# Altium schematic sheet LED_Array_Large.SchDoc
size C
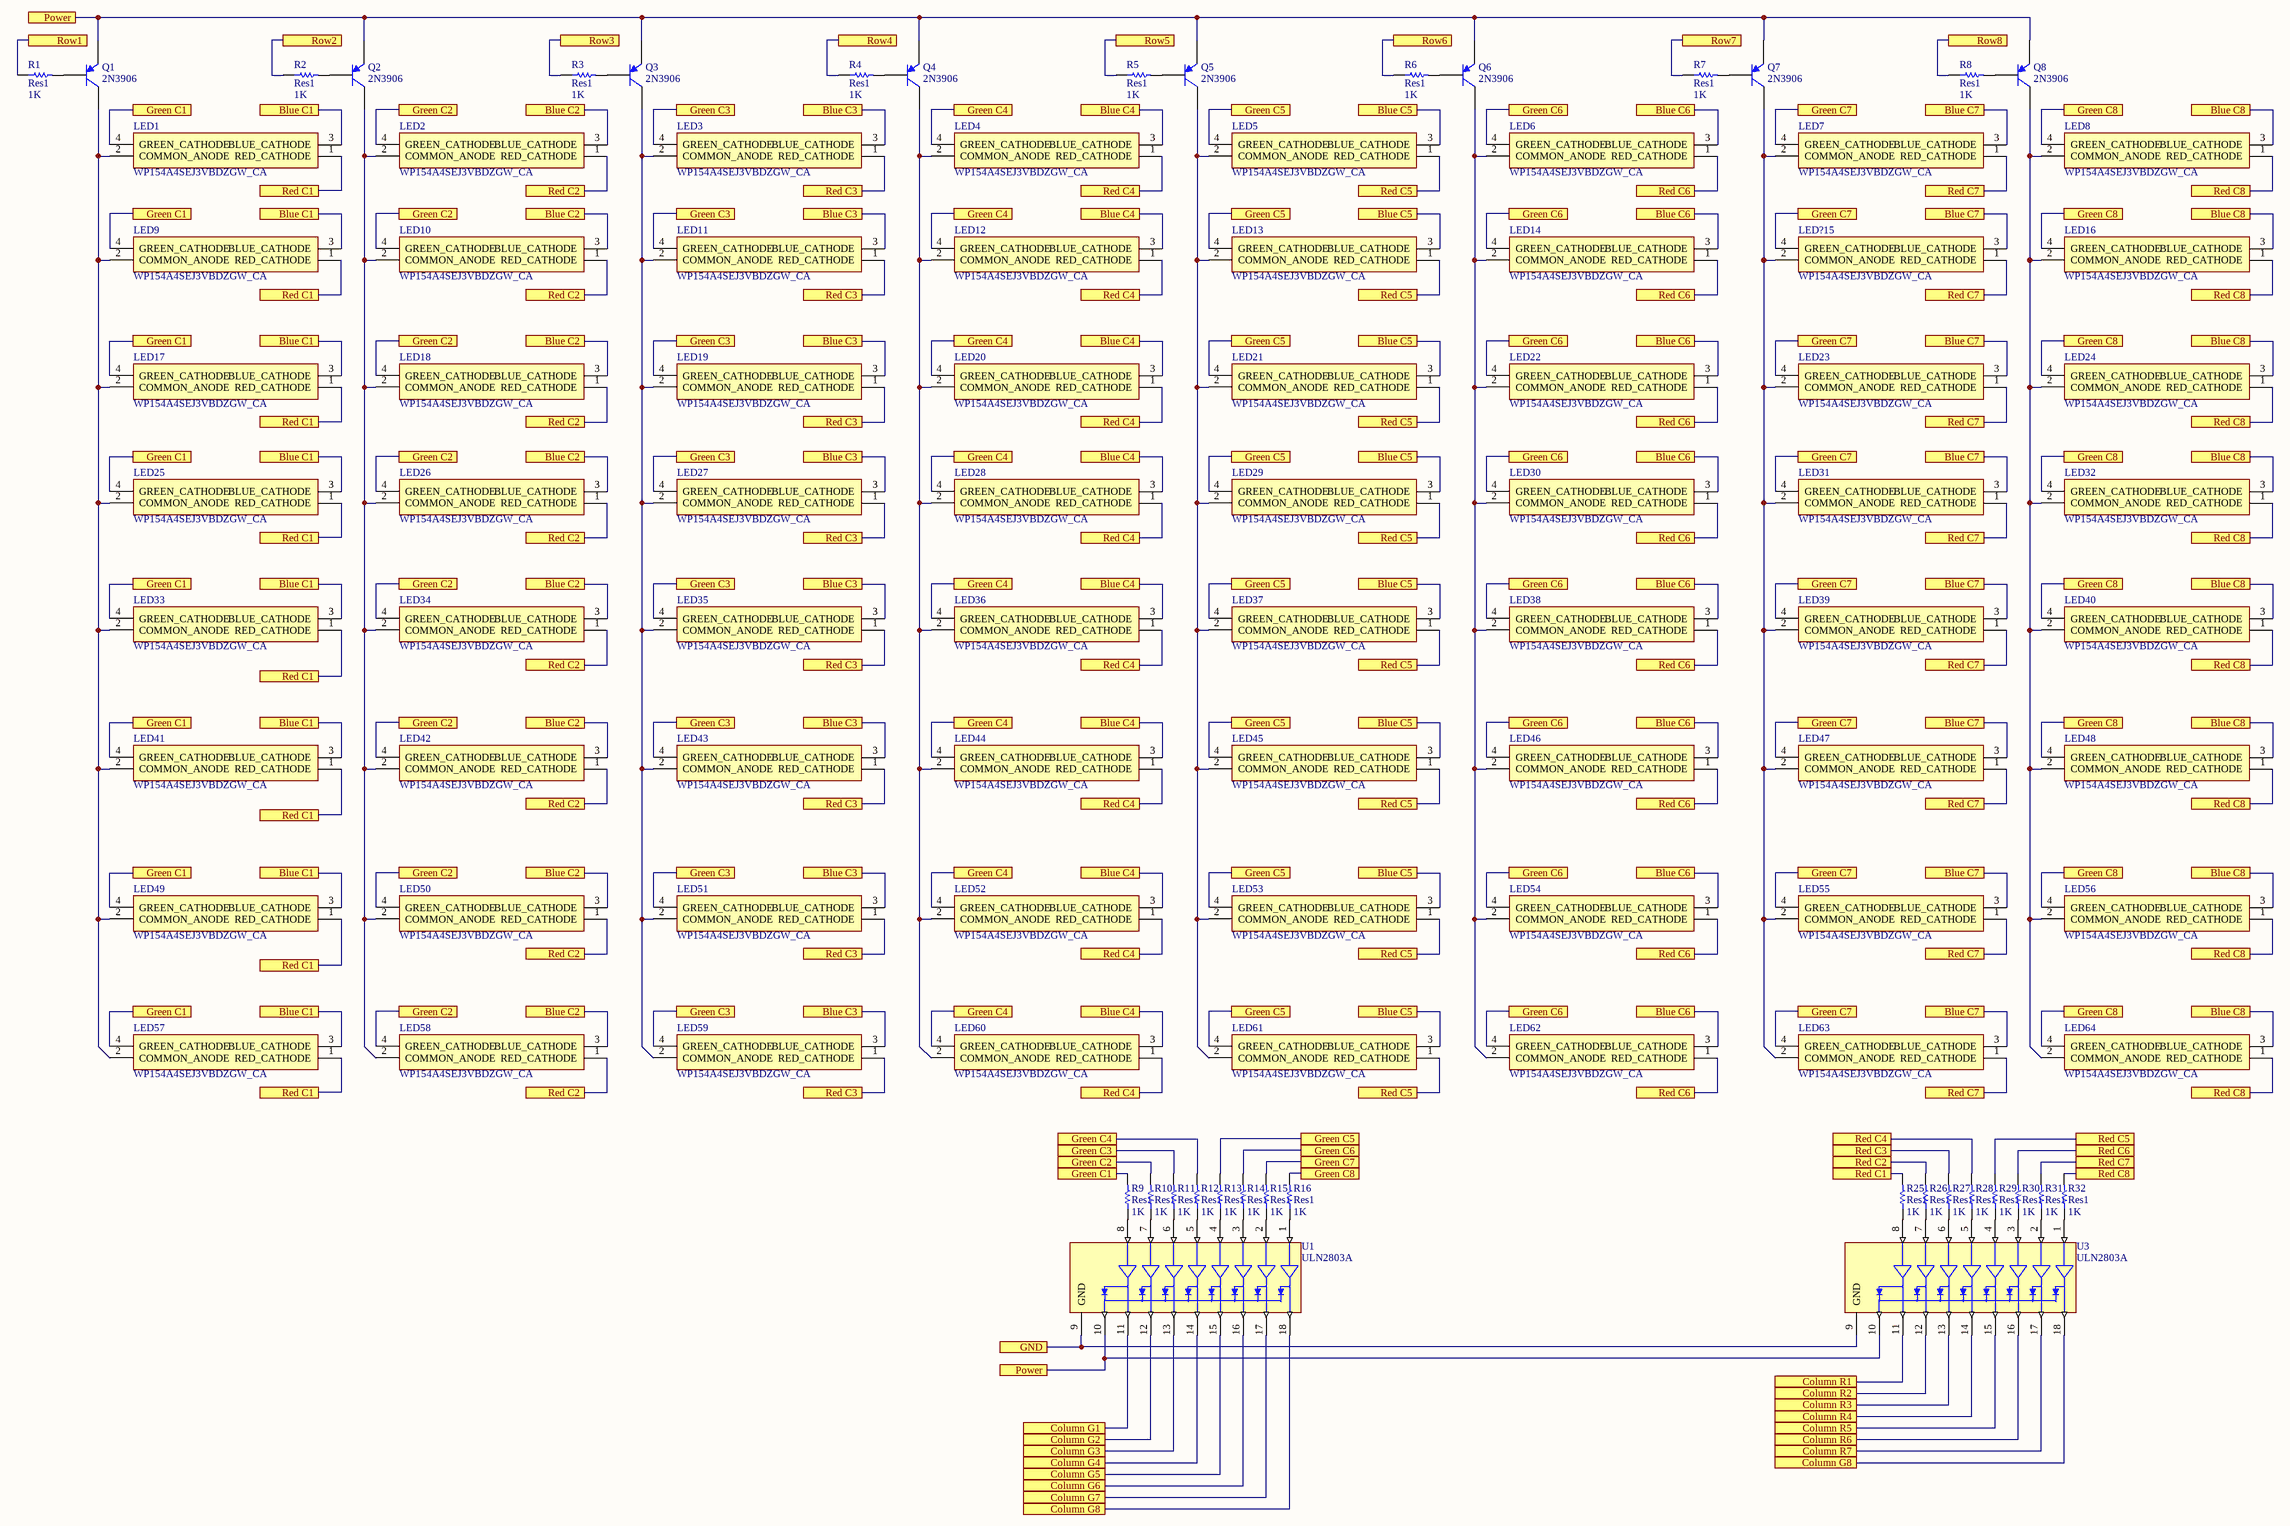
[diagram p0: LED_Array_Large.SchDoc]

## Parts
LED1  WP154A4SEJ3VBDZGW_CA  [L-154A4SUREQBFZGEC]
LED2  WP154A4SEJ3VBDZGW_CA  [L-154A4SUREQBFZGEC]
LED3  WP154A4SEJ3VBDZGW_CA  [L-154A4SUREQBFZGEC]
LED4  WP154A4SEJ3VBDZGW_CA  [L-154A4SUREQBFZGEC]
LED5  WP154A4SEJ3VBDZGW_CA  [L-154A4SUREQBFZGEC]
LED6  WP154A4SEJ3VBDZGW_CA  [L-154A4SUREQBFZGEC]
LED7  WP154A4SEJ3VBDZGW_CA  [L-154A4SUREQBFZGEC]
LED8  WP154A4SEJ3VBDZGW_CA  [L-154A4SUREQBFZGEC]
LED9  WP154A4SEJ3VBDZGW_CA  [L-154A4SUREQBFZGEC]
LED10  WP154A4SEJ3VBDZGW_CA  [L-154A4SUREQBFZGEC]
LED11  WP154A4SEJ3VBDZGW_CA  [L-154A4SUREQBFZGEC]
LED12  WP154A4SEJ3VBDZGW_CA  [L-154A4SUREQBFZGEC]
LED13  WP154A4SEJ3VBDZGW_CA  [L-154A4SUREQBFZGEC]
LED14  WP154A4SEJ3VBDZGW_CA  [L-154A4SUREQBFZGEC]
LED16  WP154A4SEJ3VBDZGW_CA  [L-154A4SUREQBFZGEC]
LED17  WP154A4SEJ3VBDZGW_CA  [L-154A4SUREQBFZGEC]
LED18  WP154A4SEJ3VBDZGW_CA  [L-154A4SUREQBFZGEC]
LED19  WP154A4SEJ3VBDZGW_CA  [L-154A4SUREQBFZGEC]
LED20  WP154A4SEJ3VBDZGW_CA  [L-154A4SUREQBFZGEC]
LED21  WP154A4SEJ3VBDZGW_CA  [L-154A4SUREQBFZGEC]
LED22  WP154A4SEJ3VBDZGW_CA  [L-154A4SUREQBFZGEC]
LED23  WP154A4SEJ3VBDZGW_CA  [L-154A4SUREQBFZGEC]
LED24  WP154A4SEJ3VBDZGW_CA  [L-154A4SUREQBFZGEC]
LED25  WP154A4SEJ3VBDZGW_CA  [L-154A4SUREQBFZGEC]
LED26  WP154A4SEJ3VBDZGW_CA  [L-154A4SUREQBFZGEC]
LED27  WP154A4SEJ3VBDZGW_CA  [L-154A4SUREQBFZGEC]
LED28  WP154A4SEJ3VBDZGW_CA  [L-154A4SUREQBFZGEC]
LED29  WP154A4SEJ3VBDZGW_CA  [L-154A4SUREQBFZGEC]
LED30  WP154A4SEJ3VBDZGW_CA  [L-154A4SUREQBFZGEC]
LED31  WP154A4SEJ3VBDZGW_CA  [L-154A4SUREQBFZGEC]
LED32  WP154A4SEJ3VBDZGW_CA  [L-154A4SUREQBFZGEC]
LED33  WP154A4SEJ3VBDZGW_CA  [L-154A4SUREQBFZGEC]
LED34  WP154A4SEJ3VBDZGW_CA  [L-154A4SUREQBFZGEC]
LED35  WP154A4SEJ3VBDZGW_CA  [L-154A4SUREQBFZGEC]
LED36  WP154A4SEJ3VBDZGW_CA  [L-154A4SUREQBFZGEC]
LED37  WP154A4SEJ3VBDZGW_CA  [L-154A4SUREQBFZGEC]
LED38  WP154A4SEJ3VBDZGW_CA  [L-154A4SUREQBFZGEC]
LED39  WP154A4SEJ3VBDZGW_CA  [L-154A4SUREQBFZGEC]
LED40  WP154A4SEJ3VBDZGW_CA  [L-154A4SUREQBFZGEC]
LED41  WP154A4SEJ3VBDZGW_CA  [L-154A4SUREQBFZGEC]
LED42  WP154A4SEJ3VBDZGW_CA  [L-154A4SUREQBFZGEC]
LED43  WP154A4SEJ3VBDZGW_CA  [L-154A4SUREQBFZGEC]
LED44  WP154A4SEJ3VBDZGW_CA  [L-154A4SUREQBFZGEC]
LED45  WP154A4SEJ3VBDZGW_CA  [L-154A4SUREQBFZGEC]
LED46  WP154A4SEJ3VBDZGW_CA  [L-154A4SUREQBFZGEC]
LED47  WP154A4SEJ3VBDZGW_CA  [L-154A4SUREQBFZGEC]
LED48  WP154A4SEJ3VBDZGW_CA  [L-154A4SUREQBFZGEC]
LED49  WP154A4SEJ3VBDZGW_CA  [L-154A4SUREQBFZGEC]
LED50  WP154A4SEJ3VBDZGW_CA  [L-154A4SUREQBFZGEC]
LED51  WP154A4SEJ3VBDZGW_CA  [L-154A4SUREQBFZGEC]
LED52  WP154A4SEJ3VBDZGW_CA  [L-154A4SUREQBFZGEC]
LED53  WP154A4SEJ3VBDZGW_CA  [L-154A4SUREQBFZGEC]
LED54  WP154A4SEJ3VBDZGW_CA  [L-154A4SUREQBFZGEC]
LED55  WP154A4SEJ3VBDZGW_CA  [L-154A4SUREQBFZGEC]
LED56  WP154A4SEJ3VBDZGW_CA  [L-154A4SUREQBFZGEC]
LED57  WP154A4SEJ3VBDZGW_CA  [L-154A4SUREQBFZGEC]
LED58  WP154A4SEJ3VBDZGW_CA  [L-154A4SUREQBFZGEC]
LED59  WP154A4SEJ3VBDZGW_CA  [L-154A4SUREQBFZGEC]
LED60  WP154A4SEJ3VBDZGW_CA  [L-154A4SUREQBFZGEC]
LED61  WP154A4SEJ3VBDZGW_CA  [L-154A4SUREQBFZGEC]
LED62  WP154A4SEJ3VBDZGW_CA  [L-154A4SUREQBFZGEC]
LED63  WP154A4SEJ3VBDZGW_CA  [L-154A4SUREQBFZGEC]
LED64  WP154A4SEJ3VBDZGW_CA  [L-154A4SUREQBFZGEC]
LED?15  WP154A4SEJ3VBDZGW_CA  [L-154A4SUREQBFZGEC]
Q1  2N3906  [TO-92A]
Q2  2N3906  [TO-92A]
Q3  2N3906  [TO-92A]
Q4  2N3906  [TO-92A]
Q5  2N3906  [TO-92A]
Q6  2N3906  [TO-92A]
Q7  2N3906  [TO-92A]
Q8  2N3906  [TO-92A]
R1  Res1  value 1K  [AXIAL-0.3]
R2  Res1  value 1K  [AXIAL-0.3]
R3  Res1  value 1K  [AXIAL-0.3]
R4  Res1  value 1K  [AXIAL-0.3]
R5  Res1  value 1K  [AXIAL-0.3]
R6  Res1  value 1K  [AXIAL-0.3]
R7  Res1  value 1K  [AXIAL-0.3]
R8  Res1  value 1K  [AXIAL-0.3]
R9  Res1  value 1K  [AXIAL-0.3]
R10  Res1  value 1K  [AXIAL-0.3]
R11  Res1  value 1K  [AXIAL-0.3]
R12  Res1  value 1K  [AXIAL-0.3]
R13  Res1  value 1K  [AXIAL-0.3]
R14  Res1  value 1K  [AXIAL-0.3]
R15  Res1  value 1K  [AXIAL-0.3]
R16  Res1  value 1K  [AXIAL-0.3]
R25  Res1  value 1K  [AXIAL-0.3]
R26  Res1  value 1K  [AXIAL-0.3]
R27  Res1  value 1K  [AXIAL-0.3]
R28  Res1  value 1K  [AXIAL-0.3]
R29  Res1  value 1K  [AXIAL-0.3]
R30  Res1  value 1K  [AXIAL-0.3]
R31  Res1  value 1K  [AXIAL-0.3]
R32  Res1  value 1K  [AXIAL-0.3]
U1  ULN2803A  [DIP850W46P254L2324H393Q18]
U3  ULN2803A  [DIP850W46P254L2324H393Q18]

## Ports
Blue C1, Blue C2, Blue C3, Blue C4, Blue C5, Blue C6, Blue C7, Blue C8, Column G1, Column G2, Column G3, Column G4, Column G5, Column G6, Column G7, Column G8, Column R1, Column R2, Column R3, Column R4, Column R5, Column R6, Column R7, GND, Green C1, Green C2, Green C3, Green C4, Green C5, Green C6, Green C7, Green C8, Power, Red C1, Red C2, Red C3, Red C4, Red C5, Red C6, Red C7, Red C8, Row1, Row2, Row3, Row4, Row5, Row6, Row7, Row8

## Nets
Blue C1: LED1.3(BLUE_CATHODE) LED9.3(BLUE_CATHODE) LED17.3(BLUE_CATHODE) LED25.3(BLUE_CATHODE) LED33.3(BLUE_CATHODE) LED41.3(BLUE_CATHODE) LED49.3(BLUE_CATHODE) LED57.3(BLUE_CATHODE) ; port Blue C1
Blue C2: LED2.3(BLUE_CATHODE) LED10.3(BLUE_CATHODE) LED18.3(BLUE_CATHODE) LED26.3(BLUE_CATHODE) LED34.3(BLUE_CATHODE) LED42.3(BLUE_CATHODE) LED50.3(BLUE_CATHODE) LED58.3(BLUE_CATHODE) ; port Blue C2
Blue C3: LED3.3(BLUE_CATHODE) LED11.3(BLUE_CATHODE) LED19.3(BLUE_CATHODE) LED27.3(BLUE_CATHODE) LED35.3(BLUE_CATHODE) LED43.3(BLUE_CATHODE) LED51.3(BLUE_CATHODE) LED59.3(BLUE_CATHODE) ; port Blue C3
Blue C4: LED4.3(BLUE_CATHODE) LED12.3(BLUE_CATHODE) LED20.3(BLUE_CATHODE) LED28.3(BLUE_CATHODE) LED36.3(BLUE_CATHODE) LED44.3(BLUE_CATHODE) LED52.3(BLUE_CATHODE) LED60.3(BLUE_CATHODE) ; port Blue C4
Blue C5: LED5.3(BLUE_CATHODE) LED13.3(BLUE_CATHODE) LED21.3(BLUE_CATHODE) LED29.3(BLUE_CATHODE) LED37.3(BLUE_CATHODE) LED45.3(BLUE_CATHODE) LED53.3(BLUE_CATHODE) LED61.3(BLUE_CATHODE) ; port Blue C5
Blue C6: LED6.3(BLUE_CATHODE) LED14.3(BLUE_CATHODE) LED22.3(BLUE_CATHODE) LED30.3(BLUE_CATHODE) LED38.3(BLUE_CATHODE) LED46.3(BLUE_CATHODE) LED54.3(BLUE_CATHODE) LED62.3(BLUE_CATHODE) ; port Blue C6
Blue C7: LED7.3(BLUE_CATHODE) LED23.3(BLUE_CATHODE) LED31.3(BLUE_CATHODE) LED39.3(BLUE_CATHODE) LED47.3(BLUE_CATHODE) LED55.3(BLUE_CATHODE) LED63.3(BLUE_CATHODE) LED?15.3(BLUE_CATHODE) ; port Blue C7
Blue C8: LED8.3(BLUE_CATHODE) LED16.3(BLUE_CATHODE) LED24.3(BLUE_CATHODE) LED32.3(BLUE_CATHODE) LED40.3(BLUE_CATHODE) LED48.3(BLUE_CATHODE) LED56.3(BLUE_CATHODE) LED64.3(BLUE_CATHODE) ; port Blue C8
Column G1: U1.11(OUT_8) ; port Column G1
Column G2: U1.12(OUT_7) ; port Column G2
Column G3: U1.13(OUT_6) ; port Column G3
Column G4: U1.14(OUT_5) ; port Column G4
Column G5: U1.15(OUT_4) ; port Column G5
Column G6: U1.16(OUT_3) ; port Column G6
Column G7: U1.17(OUT_2) ; port Column G7
Column G8: U1.18(OUT_1) U3.18(OUT_1) ; port Column G8
Column R1: U3.11(OUT_8) ; port Column R1
Column R2: U3.12(OUT_7) ; port Column R2
Column R3: U3.13(OUT_6) ; port Column R3
Column R4: U3.14(OUT_5) ; port Column R4
Column R5: U3.15(OUT_4) ; port Column R5
Column R6: U3.16(OUT_3) ; port Column R6
Column R7: U3.17(OUT_2) ; port Column R7
GND: U1.9(GND) U3.9(GND) ; port GND
Green C1: LED1.4(GREEN_CATHODE) LED9.4(GREEN_CATHODE) LED17.4(GREEN_CATHODE) LED25.4(GREEN_CATHODE) LED33.4(GREEN_CATHODE) LED41.4(GREEN_CATHODE) LED49.4(GREEN_CATHODE) LED57.4(GREEN_CATHODE) R9.2 ; port Green C1
Green C2: LED2.4(GREEN_CATHODE) LED10.4(GREEN_CATHODE) LED18.4(GREEN_CATHODE) LED26.4(GREEN_CATHODE) LED34.4(GREEN_CATHODE) LED42.4(GREEN_CATHODE) LED50.4(GREEN_CATHODE) LED58.4(GREEN_CATHODE) R10.2 ; port Green C2
Green C3: LED3.4(GREEN_CATHODE) LED11.4(GREEN_CATHODE) LED19.4(GREEN_CATHODE) LED27.4(GREEN_CATHODE) LED35.4(GREEN_CATHODE) LED43.4(GREEN_CATHODE) LED51.4(GREEN_CATHODE) LED59.4(GREEN_CATHODE) R11.2 ; port Green C3
Green C4: LED4.4(GREEN_CATHODE) LED12.4(GREEN_CATHODE) LED20.4(GREEN_CATHODE) LED28.4(GREEN_CATHODE) LED36.4(GREEN_CATHODE) LED44.4(GREEN_CATHODE) LED52.4(GREEN_CATHODE) LED60.4(GREEN_CATHODE) R12.2 ; port Green C4
Green C5: LED5.4(GREEN_CATHODE) LED13.4(GREEN_CATHODE) LED21.4(GREEN_CATHODE) LED29.4(GREEN_CATHODE) LED37.4(GREEN_CATHODE) LED45.4(GREEN_CATHODE) LED53.4(GREEN_CATHODE) LED61.4(GREEN_CATHODE) R13.2 ; port Green C5
Green C6: LED6.4(GREEN_CATHODE) LED14.4(GREEN_CATHODE) LED22.4(GREEN_CATHODE) LED30.4(GREEN_CATHODE) LED38.4(GREEN_CATHODE) LED46.4(GREEN_CATHODE) LED54.4(GREEN_CATHODE) LED62.4(GREEN_CATHODE) R14.2 ; port Green C6
Green C7: LED7.4(GREEN_CATHODE) LED23.4(GREEN_CATHODE) LED31.4(GREEN_CATHODE) LED39.4(GREEN_CATHODE) LED47.4(GREEN_CATHODE) LED55.4(GREEN_CATHODE) LED63.4(GREEN_CATHODE) LED?15.4(GREEN_CATHODE) R15.2 ; port Green C7
Green C8: LED8.4(GREEN_CATHODE) LED16.4(GREEN_CATHODE) LED24.4(GREEN_CATHODE) LED32.4(GREEN_CATHODE) LED40.4(GREEN_CATHODE) LED48.4(GREEN_CATHODE) LED56.4(GREEN_CATHODE) LED64.4(GREEN_CATHODE) R16.2 ; port Green C8
Power: Q1.1(E) Q2.1(E) Q3.1(E) Q4.1(E) Q5.1(E) Q6.1(E) Q7.1(E) Q8.1(E) U1.10(COMMON) U3.10(COMMON) ; port Power
Red C1: LED1.1(RED_CATHODE) LED9.1(RED_CATHODE) LED17.1(RED_CATHODE) LED25.1(RED_CATHODE) LED33.1(RED_CATHODE) LED41.1(RED_CATHODE) LED49.1(RED_CATHODE) LED57.1(RED_CATHODE) R25.2 ; port Red C1
Red C2: LED2.1(RED_CATHODE) LED10.1(RED_CATHODE) LED18.1(RED_CATHODE) LED26.1(RED_CATHODE) LED34.1(RED_CATHODE) LED42.1(RED_CATHODE) LED50.1(RED_CATHODE) LED58.1(RED_CATHODE) R26.2 ; port Red C2
Red C3: LED3.1(RED_CATHODE) LED11.1(RED_CATHODE) LED19.1(RED_CATHODE) LED27.1(RED_CATHODE) LED35.1(RED_CATHODE) LED43.1(RED_CATHODE) LED51.1(RED_CATHODE) LED59.1(RED_CATHODE) R27.2 ; port Red C3
Red C4: LED4.1(RED_CATHODE) LED12.1(RED_CATHODE) LED20.1(RED_CATHODE) LED28.1(RED_CATHODE) LED36.1(RED_CATHODE) LED44.1(RED_CATHODE) LED52.1(RED_CATHODE) LED60.1(RED_CATHODE) R28.2 ; port Red C4
Red C5: LED5.1(RED_CATHODE) LED13.1(RED_CATHODE) LED21.1(RED_CATHODE) LED29.1(RED_CATHODE) LED37.1(RED_CATHODE) LED45.1(RED_CATHODE) LED53.1(RED_CATHODE) LED61.1(RED_CATHODE) R29.2 ; port Red C5
Red C6: LED6.1(RED_CATHODE) LED14.1(RED_CATHODE) LED22.1(RED_CATHODE) LED30.1(RED_CATHODE) LED38.1(RED_CATHODE) LED46.1(RED_CATHODE) LED54.1(RED_CATHODE) LED62.1(RED_CATHODE) R30.2 ; port Red C6
Red C7: LED7.1(RED_CATHODE) LED23.1(RED_CATHODE) LED31.1(RED_CATHODE) LED39.1(RED_CATHODE) LED47.1(RED_CATHODE) LED55.1(RED_CATHODE) LED63.1(RED_CATHODE) LED?15.1(RED_CATHODE) R31.2 ; port Red C7
Red C8: LED8.1(RED_CATHODE) LED16.1(RED_CATHODE) LED24.1(RED_CATHODE) LED32.1(RED_CATHODE) LED40.1(RED_CATHODE) LED48.1(RED_CATHODE) LED56.1(RED_CATHODE) LED64.1(RED_CATHODE) R32.2 ; port Red C8
Row1: R1.1 ; port Row1
Row2: R2.1 ; port Row2
Row3: R3.1 ; port Row3
Row4: R4.1 ; port Row4
Row5: R5.1 ; port Row5
Row6: R6.1 ; port Row6
Row7: R7.1 ; port Row7
Row8: R8.1 ; port Row8
NetLED1_2: LED1.2(COMMON_ANODE) LED9.2(COMMON_ANODE) LED17.2(COMMON_ANODE) LED25.2(COMMON_ANODE) LED33.2(COMMON_ANODE) LED41.2(COMMON_ANODE) LED49.2(COMMON_ANODE) LED57.2(COMMON_ANODE) Q1.3(C)
NetLED2_2: LED2.2(COMMON_ANODE) LED10.2(COMMON_ANODE) LED18.2(COMMON_ANODE) LED26.2(COMMON_ANODE) LED34.2(COMMON_ANODE) LED42.2(COMMON_ANODE) LED50.2(COMMON_ANODE) LED58.2(COMMON_ANODE) Q2.3(C)
NetLED3_2: LED3.2(COMMON_ANODE) LED11.2(COMMON_ANODE) LED19.2(COMMON_ANODE) LED27.2(COMMON_ANODE) LED35.2(COMMON_ANODE) LED43.2(COMMON_ANODE) LED51.2(COMMON_ANODE) LED59.2(COMMON_ANODE) Q3.3(C)
NetLED4_2: LED4.2(COMMON_ANODE) LED12.2(COMMON_ANODE) LED20.2(COMMON_ANODE) LED28.2(COMMON_ANODE) LED36.2(COMMON_ANODE) LED44.2(COMMON_ANODE) LED52.2(COMMON_ANODE) LED60.2(COMMON_ANODE) Q4.3(C)
NetLED5_2: LED5.2(COMMON_ANODE) LED13.2(COMMON_ANODE) LED21.2(COMMON_ANODE) LED29.2(COMMON_ANODE) LED37.2(COMMON_ANODE) LED45.2(COMMON_ANODE) LED53.2(COMMON_ANODE) LED61.2(COMMON_ANODE) Q5.3(C)
NetLED6_2: LED6.2(COMMON_ANODE) LED14.2(COMMON_ANODE) LED22.2(COMMON_ANODE) LED30.2(COMMON_ANODE) LED38.2(COMMON_ANODE) LED46.2(COMMON_ANODE) LED54.2(COMMON_ANODE) LED62.2(COMMON_ANODE) Q6.3(C)
NetLED7_2: LED7.2(COMMON_ANODE) LED23.2(COMMON_ANODE) LED31.2(COMMON_ANODE) LED39.2(COMMON_ANODE) LED47.2(COMMON_ANODE) LED55.2(COMMON_ANODE) LED63.2(COMMON_ANODE) LED?15.2(COMMON_ANODE) Q7.3(C)
NetLED8_2: LED8.2(COMMON_ANODE) LED16.2(COMMON_ANODE) LED24.2(COMMON_ANODE) LED32.2(COMMON_ANODE) LED40.2(COMMON_ANODE) LED48.2(COMMON_ANODE) LED56.2(COMMON_ANODE) LED64.2(COMMON_ANODE) Q8.3(C)
NetQ1_2: Q1.2(B) R1.2
NetQ2_2: Q2.2(B) R2.2
NetQ3_2: Q3.2(B) R3.2
NetQ4_2: Q4.2(B) R4.2
NetQ5_2: Q5.2(B) R5.2
NetQ6_2: Q6.2(B) R6.2
NetQ7_2: Q7.2(B) R7.2
NetQ8_2: Q8.2(B) R8.2
NetR9_1: R9.1 U1.8(IN_8)
NetR10_1: R10.1 U1.7(IN_7)
NetR11_1: R11.1 U1.6(IN_6)
NetR12_1: R12.1 U1.5(IN_5)
NetR13_1: R13.1 U1.4(IN_4)
NetR14_1: R14.1 U1.3(IN_3)
NetR15_1: R15.1 U1.2(IN_2)
NetR16_1: R16.1 U1.1(IN_1)
NetR25_1: R25.1 U3.8(IN_8)
NetR26_1: R26.1 U3.7(IN_7)
NetR27_1: R27.1 U3.6(IN_6)
NetR28_1: R28.1 U3.5(IN_5)
NetR29_1: R29.1 U3.4(IN_4)
NetR30_1: R30.1 U3.3(IN_3)
NetR31_1: R31.1 U3.2(IN_2)
NetR32_1: R32.1 U3.1(IN_1)

## Library data of the parts
LED1-LED14 LED16-LED64 LED?15 = WP154A4SEJ3VBDZGW_CA: LED; Manufacturer_Name: Kingbright; Manufacturer_Part_Number: WP154A4SEJ3VBDZGW/CA; Datasheet Link: http://www.kingbrightusa.com/images/catalog/SPEC/WP154A4SEJ3VBDZGW-CA.pdf; Mouser Part Number: 604-WP154A43VBDZGWCA; Mouser Price/Stock: https://www.mouser.co.uk/ProductDetail/Kingbright/WP154A4SEJ3VBDZGW-CA/?qs=YCa%2FAAYMW01xRqZww6UuiQ%3D%3D; Arrow Part Number: WP154A4SEJ3VBDZGW/CA; Arrow Price/Stock: https://www.arrow.com/en/products/wp154a4sej3vbdzgwca/kingbright
Q1-Q8 = 2N3906: PNP General Purpose Amplifier; Published: 8-Jun-2000; LatestRevisionDate: 15-Jan-2003; LatestRevisionNote: PCB Footprint 'BCY-W3/D4.7' replaced; DatasheetVersion: 1997; PackageVersion: Sep-1998; PackageReference: TO-92A; Publisher: Altium Limited; PackageDescription: TO, Flat Index; 3 In-Line, Axial Leads; Body Dia. 4.5mm; Leads 0.51 x 0.48 mm (max); ComponentLink1Description: Manufacturer Link; ComponentLink1URL: http://www.fairchildsemi.com/; ComponentLink2Description: Datasheet; ComponentLink2URL: http://www.fairchildsemi.com/ds/2N%2F2N3906.pdf
R1-R16 R25-R32 = Res1: Resistor; Published: 8-Jun-2000; LatestRevisionDate: 17-Jul-2002; LatestRevisionNote: Re-released for DXP Platform.; PackageReference: AXIAL-0.3; Publisher: Altium Limited; PackageDescription: Axial Device, Thru-Hole; 2 Leads; 0.3 in Pin Spacing
U1 U3 = ULN2803A: Bipolar _BJT_ Transistor Array 8 NPN Darlington 50V 500mA 2.25W Through Hole 18-DIP; MF: STMicroelectronics; Value: *; MP: ULN2803A; Package: DIP-18 STMicroelectronics; Price: None; SnapEDA_Link: https://www.snapeda.com/parts/ULN2803A/STMicroelectronics/view-part/697285/?ref=snap; Availability: Unavailable